# Altium schematic sheet USB_BREAKOUTS_CCU_HAS.SchDoc: CCU - USB/Sensor/Breakouts
size B; DrawnBy: M. Seago; Organization: Gravitas; Address1: Sponsored By:; Address2: Alan Morgan; Address3: Technical Advisor:; Address4: Dr. Joseph Morgan; Revision: 1A; SheetNumber: 4; SheetTotal: 9
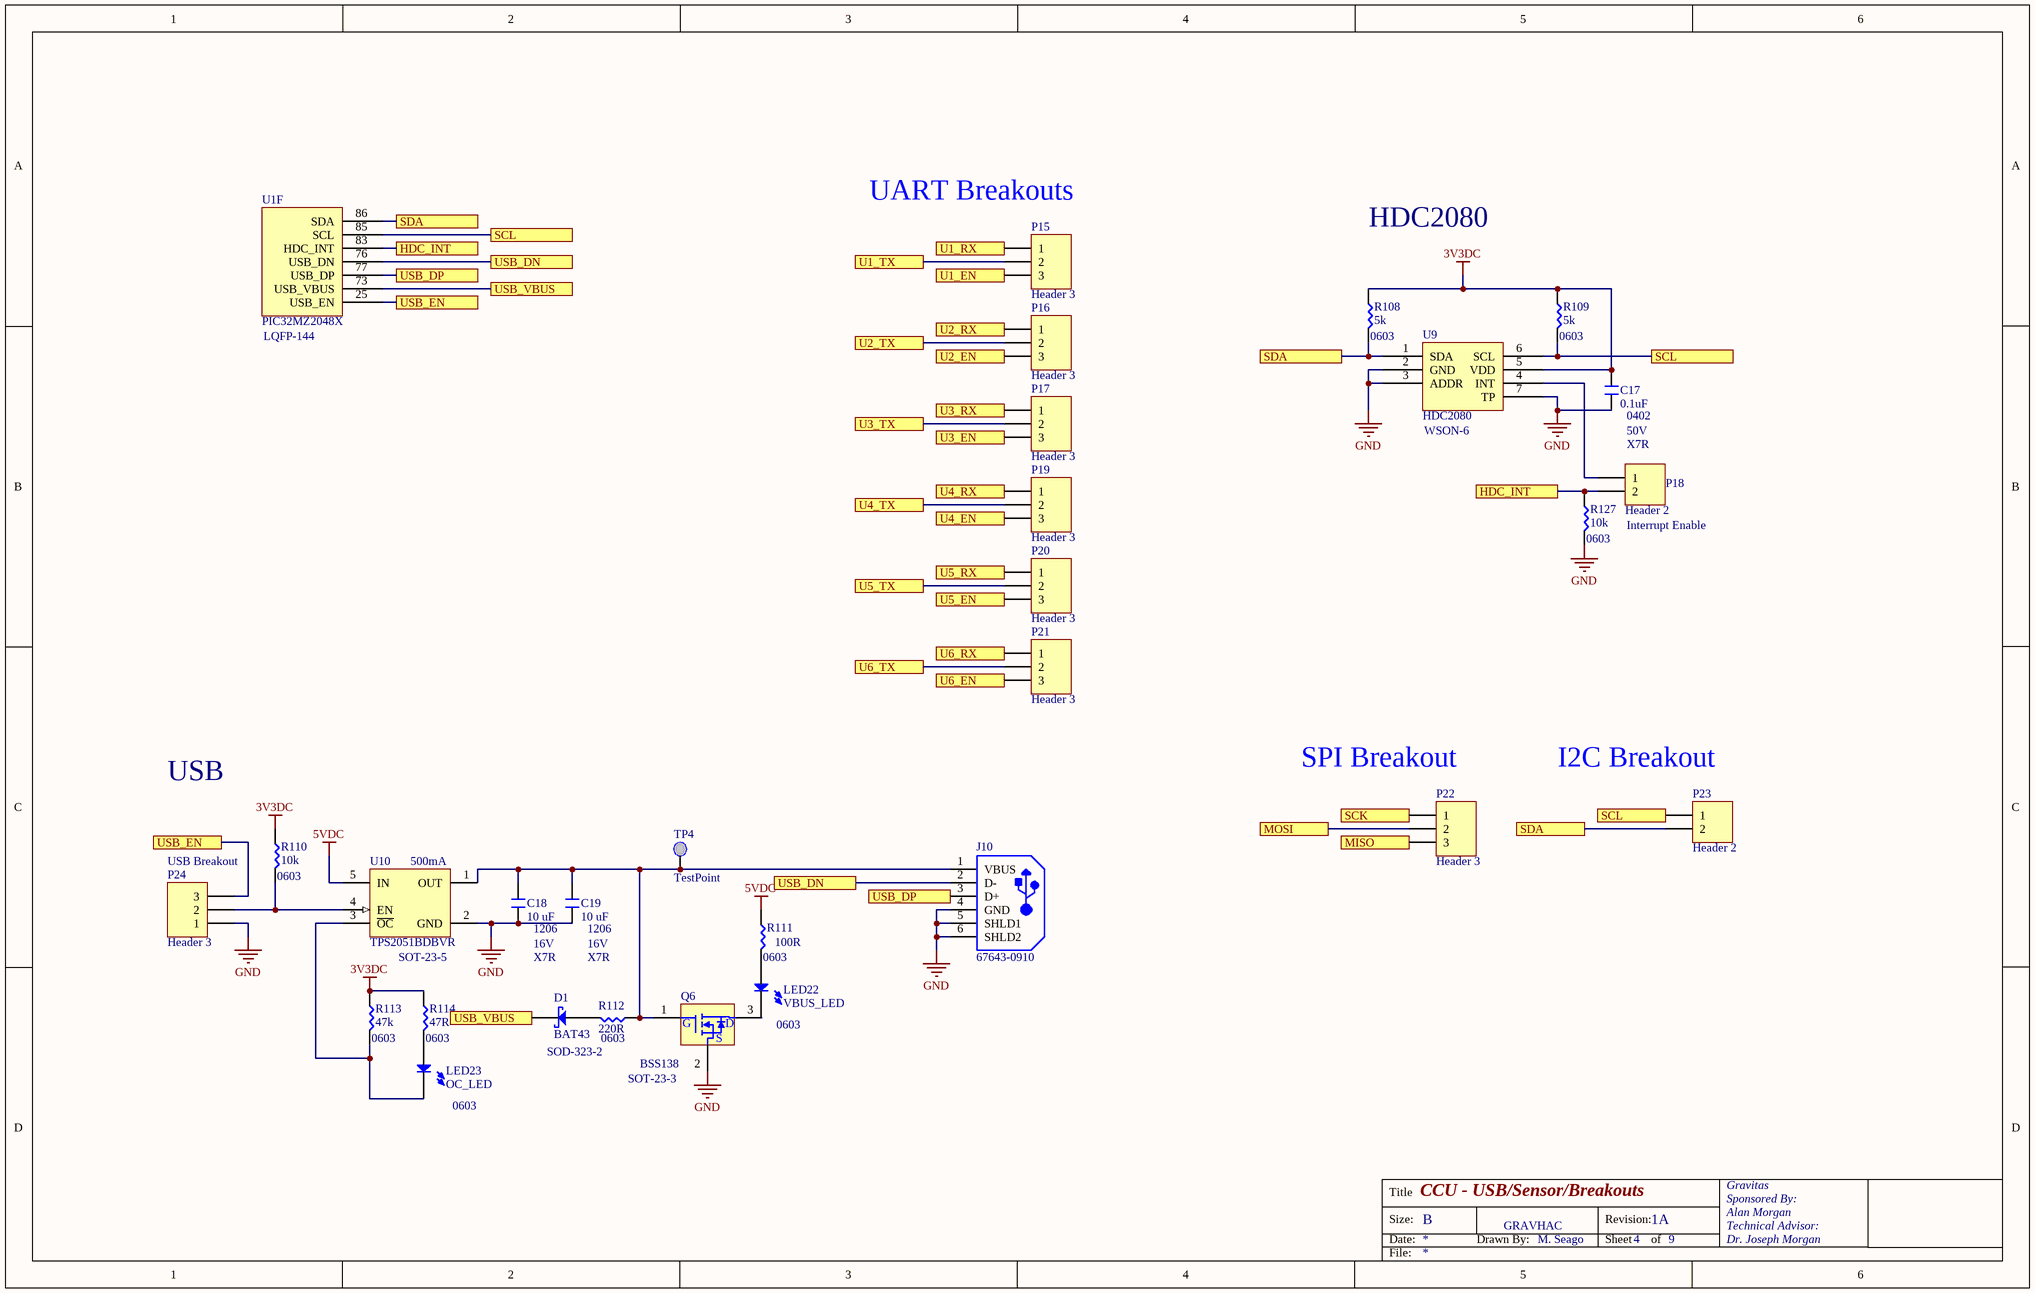
[diagram p0: USB_BREAKOUTS_CCU_HAS.SchDoc]

## Parts
C17  0.1uF  [NonPolar-0402]
C18  10 uF  [NONPOLAR-1206]
C19  10 uF  [NONPOLAR-1206]
D1  BAT43  [BAT43WS-E3-08]
J10  67643-0910  [TE-292303-1_V]
LED22  VBUS_LED  [LED-0603]
LED23  OC_LED  [LED-0603]
P15  Header 3  [HDR1X3]
P16  Header 3  [HDR1X3]
P17  Header 3  [HDR1X3]
P18  Header 2  [HDR1X2]
P19  Header 3  [HDR1X3]
P20  Header 3  [HDR1X3]
P21  Header 3  [HDR1X3]
P22  Header 3  [HDR1X3]
P23  Header 2  [HDR1X2]
P24  Header 3  [HDR1X3]
Q6  BSS138  [BSS138-SOT23]
R108  5k  [NonPolar-0603]
R109  5k  [NonPolar-0603]
R110  10k  [NonPolar-0603]
R111  100R  [NonPolar-0603]
R112  220R  [NonPolar-0603]
R113  47k  [NonPolar-0603]
R114  47R  [NonPolar-0603]
R127  10k  [NonPolar-0603]
TP4  TestPoint  [TP - S2751-46R]
U1  PIC32MZ2048X  [BIG_PIC32MZ]  (part F of 7)
U9  HDC2080  [HDC2080]
U10  TPS2051BDBVR  [DBV0005A_L]

## Ports
HDC_INT, MISO, MOSI, SCK, SCL, SDA, U1_EN, U1_RX, U1_TX, U2_EN, U2_RX, U2_TX, U3_EN, U3_RX, U3_TX, U4_EN, U4_RX, U4_TX, U5_EN, U5_RX, U5_TX, U6_EN, U6_RX, U6_TX, USB_DN, USB_DP, USB_EN, USB_VBUS

## Nets
3V3DC: C17.2 R108.2 R109.2 R110.2 R113.2 R114.2 U9.5(VDD)
5VDC: R111.2 U10.5(IN)
GND: C17.1 C18.1 C19.1 J10.4(GND) J10.5(SHLD1) J10.6(SHLD2) P24.1 Q6.2(S) R127.1 U9.2(GND) U9.3(ADDR) U9.7(TP) U10.2(GND)
HDC_INT: P18.2 R127.2 U1.83(HDC_INT) ; port HDC_INT
MISO: P22.3 ; port MISO
MOSI: P22.2 ; port MOSI
SCK: P22.1 ; port SCK
SCL: P23.1 R109.1 U1.85(SCL) U9.6(SCL) ; port SCL
SDA: P23.2 R108.1 U1.86(SDA) U9.1(SDA) ; port SDA
U1_EN: P15.3 ; port U1_EN
U1_RX: P15.1 ; port U1_RX
U1_TX: P15.2 ; port U1_TX
U2_EN: P16.3 ; port U2_EN
U2_RX: P16.1 ; port U2_RX
U2_TX: P16.2 ; port U2_TX
U3_EN: P17.3 ; port U3_EN
U3_RX: P17.1 ; port U3_RX
U3_TX: P17.2 ; port U3_TX
U4_EN: P19.3 ; port U4_EN
U4_RX: P19.1 ; port U4_RX
U4_TX: P19.2 ; port U4_TX
U5_EN: P20.3 ; port U5_EN
U5_RX: P20.1 ; port U5_RX
U5_TX: P20.2 ; port U5_TX
U6_EN: P21.3 ; port U6_EN
U6_RX: P21.1 ; port U6_RX
U6_TX: P21.2 ; port U6_TX
USB_DN: J10.2(D-) U1.76(USB_DN) ; port USB_DN
USB_DP: J10.3(D+) U1.77(USB_DP) ; port USB_DP
USB_EN: P24.3 U1.25(USB_EN) ; port USB_EN
USB_VBUS: D1.1 U1.73(USB_VBUS) ; port USB_VBUS
NetC18_2: C18.2 C19.2 J10.1(VBUS) Q6.1(G) R112.2 TP4.1 U10.1(OUT)
NetD1_2: D1.2 R112.1
NetLED22_1: LED22.1 R111.1
NetLED22_2: LED22.2 Q6.3(D)
NetLED23_1: LED23.1 R114.1
NetLED23_2: LED23.2 R113.1 U10.3(~{OC})
NetP18_1: P18.1 U9.4(INT)
NetP24_2: P24.2 R110.1 U10.4(EN)

## Notes on the sheet
- (near P15) UART Breakouts
- HDC2080
- (near U1) LQFP-144
- (near R108) 0603
- (near R109) 0603
- (near U9) WSON-6
- (near C17) 0402
- 50V
- (near P18) X7R
- (near R127) 0603
- Interrupt Enable
- (near P22) SPI Breakout
- (near P23) I2C Breakout
- USB
- USB Breakout
- (near R110) 0603
- (near U10) 500mA
- SOT-23-5
- 1206
- 16V
- X7R
- (near C19) 1206
- (near C19) 16V
- (near R111) 0603
- (near R113) 0603
- (near R114) 0603
- (near R112) 0603
- 0603
- (near LED23) 0603
- SOD-323-2
- (near Q6) SOT-23-3
- GRAVHAC
- Title
- Size:
- Date:
- B
- Drawn By:
- Revision:
- Sheet
- of
- File:

## Library data of the parts
C17 = Cap - 0402
C18 C19 = Cap - 1206: CGA5L1X7R1E106K160AE
D1 = BAT43: BAT43WS-E3-08
J10 = CMP-2000-05404-1: 1 Port Right Angle Through Hole Mount Female Type A USB Connector, 4 Position, -55 to 85 degC, RoHS, Tube; Manufacturer: TE Connectivity; Contact Termination Type: Solder; No. of Contacts: 4; Connector Mounting: PCB; SVHC: NoSVHC(16-Jun-2014); Gender: Receptacle; Connector Type: USBA; Package Description: 4-Pin Through Hole Device, Body 14 x 13.13 mm, Pitch 2.5 mm; Contact Plating: Gold; Package Reference: 292303-1; Contact Material: Copper; Datasheet URL: http://www.farnell.com/cad/1653030.pdf; Datasheet Version: Feb-12; Manufacturer URL: http://www.te.com/
LED22 LED23 = LED-0603
P15-P17 P19-P22 P24 = Header 3: Header, 3-Pin; LatestRevisionDate: 17-Jul-2002; LatestRevisionNote: Re-released for DXP Platform.; Publisher: Altium Limited
P18 P23 = Header 2: Header, 2-Pin; LatestRevisionDate: 17-Jul-2002; LatestRevisionNote: Re-released for DXP Platform.; Publisher: Altium Limited
R108-R114 R127 = Res - 0603
TP4 = TestPoint: S2751-46R
U10 = CMP-2000-07277-1: Current-Limited, Power-Distribution Switch, 2.7 to 5.5 V, -40 to 85 degC, 5-Pin SOT-23 (DBV), Green (RoHS & no Sb/Br), Tape and Reel; Manufacturer: TexasInstruments; Number of Outputs: 1Output; Operating Supply Voltage: 2.7Vto5.5V; Supply Voltage - Min: 2.7V; Supply Voltage - Max: 5.5V; Current Limit: 1A; Development Kit: TPS2051BEVM; Output Current: 500mA; On Resistance - Max: 70mOhms; Package Version: 4073253-4/N, 12/2014; Mounting Technology: SurfaceMount; Packaging: Reel; Package / Case: SOT-23-5; Maximum Operating Temperature: +85C; Package Description: 5-Pin Small Outline Transistor, Body 2.9 x 1.6 mm, Pitch 0.95 mm; Type: HighSide; Product: USBCurrentLimitedPowerSwitches; Minimum Operating Temperature: -40C; Manufacturer URL: http://www.ti.com/; Factory Pack Quantity: 3000; Mounting Style: SMD/SMT; Brand: TexasInstruments; Package Reference: DBV5; Package URL: http://www.ti.com/lit/ml/mpds018l/mpds018l.pdf; Datasheet URL: http://www.ti.com/general/docs/lit/getliterature.tsp?genericPartNumber=TPS2051B&fileType=pdf; Product Category: PowerSwitchICs-PowerDistribution; Series: TPS2051B; Datasheet Version: Rev. L, 06/2011; RoHS: Details